# Altium schematic sheet DSO_IO.SchDoc: Schematic_Name
size A4; CompanyName: University of Melbourne; Engineer: Your Name Here; DocumentNumber: 1; Revision: 0.1; SheetNumber: 1; SheetTotal: 1; Title_Project: Project_Title; StudentNo: Student No.
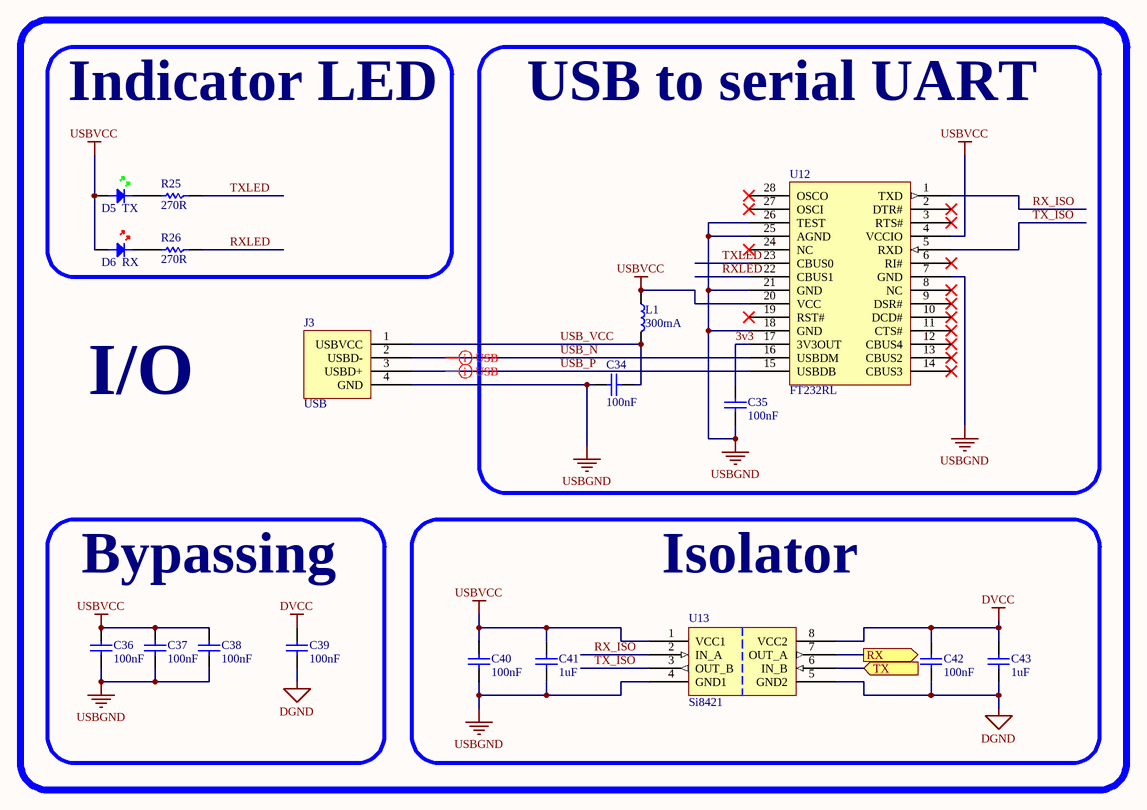
[diagram p0: DSO_IO.SchDoc]

## Parts
C34  100nF  [0805C]
C35  100nF  [0805C]
C36  100nF  [0805C]
C37  100nF  [0805C]
C38  100nF  [0805C]
C39  100nF  [0805C]
C40  100nF  [0805C]
C41  1uF  [0805C]
C42  100nF  [0805C]
C43  1uF  [0805C]
D5  TX  [0805D-GREEN]
D6  RX  [0805D-RED]
J3  USB  [USBPLUG]
L1  300mA  [0805]
R25  270R  [0805]
R26  270R  [0805]
U12  FT232RL  [SSOP-28]
U13  Si8421  [SOIC-8]

## Blocks framed on the sheet
I/O: J3
Indicator LED: D5 D6 R25 R26
USB to serial UART: C34 C35 L1 U12
Bypassing: C36-C39
Isolator: C40-C43 U13

## Ports
RX (out), TX (in)

## Nets
DGND: C39.2 C42.2 C43.2 U13.5(GND2)
DVCC: C39.1 C42.1 C43.1 U13.8(VCC2)
USBGND: C34.2 C35.2 C36.2 C37.2 C38.2 C40.2 C41.2 J3.4(GND) U12.7(GND) U12.18(GND) U12.21(GND) U12.25(AGND) U12.26(TEST) U13.4(GND1)
USBVCC: C36.1 C37.1 C38.1 C40.1 C41.1 D5.A D6.A L1.1 U12.4(VCCIO) U12.20(VCC) U13.1(VCC1)
3v3: C35.1 U12.17(3V3OUT)
RX: U13.7(OUT_A) ; port RX
RX_ISO: U12.1(TXD) U13.2(IN_A)
RXLED: R26.1 U12.22(CBUS1)
TX: U13.6(IN_B) ; port TX
TX_ISO: U12.5(RXD) U13.3(OUT_B)
TXLED: R25.1 U12.23(CBUS0)
USB_N: J3.2(USBD-) U12.16(USBDM)
USB_P: J3.3(USBD+) U12.15(USBDB)
USB_VCC: C34.1 J3.1(USBVCC) L1.2
NetD5_K: D5.K R25.2
NetD6_K: D6.K R26.2

Not connected (* = marked no-connect by the designer): U12 2(DTR#)* 3(RTS#)* 6(RI#)* 8(NC)* 9(DSR#)* 10(DCD#)* 11(CTS#)* 12(CBUS4)* 13(CBUS2)* 14(CBUS3)* 19(RST#)* 24(NC)* 27(OSCI)* 28(OSCO)*

## Layout directives
differential pair: USB_N, USB_P

## Library data of the parts
C34-C43 = C: Capacitor; Reviewed by: RM - 2018/08/05; Revision: July-2002: Re-released for DXP Platform.; Supplier 1: *; Supplier Part Number 1: *
  C34-C40 C42: Value: 100nF
  C41 C43: Value: 1uF
D5 = LED GREEN: Light Emitting Diode; Reviewed by: RM - 2018/08/05; Revision: July-2002: Re-released for DXP Platform.; Supplier 1: Digi-Key; Supplier Part Number 1: 160-1423-1-ND
D6 = LED RED: Light Emitting Diode; Reviewed by: RM - 2018/08/05; Revision: July-2002: Re-released for DXP Platform.; Supplier 1: Digi-Key; Supplier Part Number 1: 475-1415-1-ND
J3 = USBPLUG: USB B Type Connector; Reviewed by: RM - 2018/08/05; Supplier 1: Digi-Key; Supplier Part Number 1: 609-1039-ND
L1 = I: Inductor; Reviewed by: RM - 2018/08/05; Value: 300mA; Supplier 1: *; Supplier Part Number 1: *
R25 R26 = R: Resistor; Reviewed by: RM - 2018/08/05; Value: 270R; Supplier 1: *; Suppler Part Number 1: *
U12 = FT232RL: USB to Serial bridge; Reviewed by: RM - 2018/08/05; Supplier 1: Digi-Key; Supplier Part Number 1: 768-1007-1-ND
U13 = Si8421: Dual Channel Digital Isolator Both Ways; Reviewed by: RM - 2018/08/05; Supplier 1: Digi-Key; Supplier Part Number 1: 336-1755-5-ND